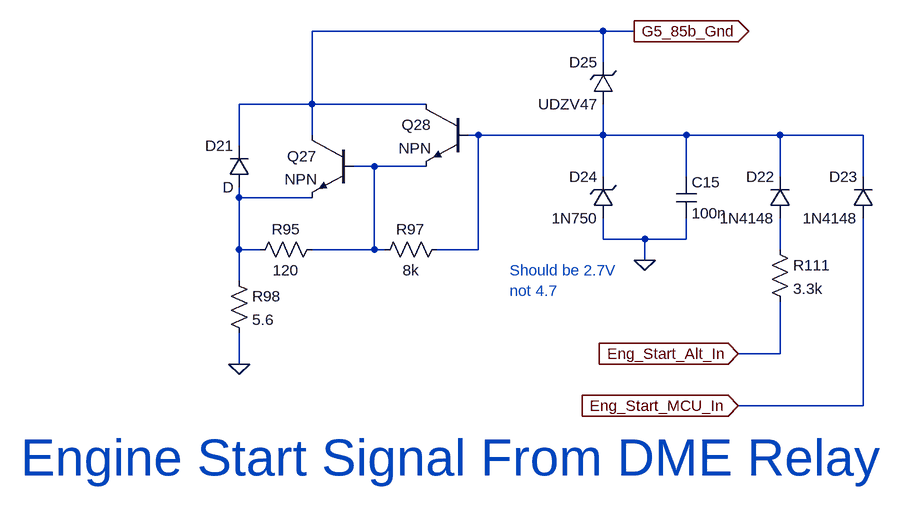
[diagram p0: schematic engine_start.asc]
engine_start.asc, the LTspice schematic file:
Version 4
SHEET 1 4356 3824
WIRE -1856 -3440 -2304 -3440
WIRE -1808 -3440 -1856 -3440
WIRE -1856 -3392 -1856 -3440
WIRE -2304 -3328 -2304 -3440
WIRE -2304 -3328 -2416 -3328
WIRE -2128 -3328 -2304 -3328
WIRE -2304 -3280 -2304 -3328
WIRE -2048 -3280 -2064 -3280
WIRE -1856 -3280 -1856 -3328
WIRE -1856 -3280 -2048 -3280
WIRE -1728 -3280 -1856 -3280
WIRE -1584 -3280 -1728 -3280
WIRE -1456 -3280 -1584 -3280
WIRE -2416 -3264 -2416 -3328
WIRE -2208 -3232 -2240 -3232
WIRE -2128 -3232 -2208 -3232
WIRE -1856 -3216 -1856 -3280
WIRE -1728 -3216 -1728 -3280
WIRE -1584 -3216 -1584 -3280
WIRE -1456 -3216 -1456 -3280
WIRE -2416 -3184 -2416 -3200
WIRE -2304 -3184 -2416 -3184
WIRE -1856 -3120 -1856 -3152
WIRE -1792 -3120 -1856 -3120
WIRE -1728 -3120 -1728 -3152
WIRE -1728 -3120 -1792 -3120
WIRE -2416 -3104 -2416 -3184
WIRE -2384 -3104 -2416 -3104
WIRE -2208 -3104 -2208 -3232
WIRE -2208 -3104 -2304 -3104
WIRE -2192 -3104 -2208 -3104
WIRE -2048 -3104 -2048 -3280
WIRE -2048 -3104 -2112 -3104
WIRE -1584 -3104 -1584 -3152
WIRE -1792 -3088 -1792 -3120
WIRE -2416 -3056 -2416 -3104
WIRE -1584 -2944 -1584 -3024
WIRE -1584 -2944 -1648 -2944
WIRE -2416 -2928 -2416 -2976
WIRE -1456 -2864 -1456 -3152
WIRE -1456 -2864 -1648 -2864
FLAG -2416 -2928 0
FLAG -1808 -3440 G5_85b_Gnd
IOPIN -1808 -3440 Out
FLAG -1792 -3088 0
FLAG -1648 -2944 Eng_Start_Alt_In
IOPIN -1648 -2944 In
FLAG -1648 -2864 Eng_Start_MCU_In
IOPIN -1648 -2864 In
SYMBOL npn -2240 -3280 M0
SYMATTR InstName Q27
SYMBOL npn -2064 -3328 M0
SYMATTR InstName Q28
SYMBOL diode -2400 -3200 R180
WINDOW 0 24 64 Left 2
WINDOW 3 24 0 Left 2
SYMATTR InstName D21
SYMBOL Res -2288 -3120 R90
WINDOW 0 0 56 VBottom 2
WINDOW 3 32 56 VTop 2
SYMATTR InstName R95
SYMATTR Value 120
SYMBOL Res -2208 -3088 R270
WINDOW 0 32 56 VTop 2
WINDOW 3 0 56 VBottom 2
SYMATTR InstName R97
SYMATTR Value 8k
SYMBOL Res -2432 -3072 R0
SYMATTR InstName R98
SYMATTR Value 5.6
SYMBOL diode -1568 -3152 R180
WINDOW 0 24 64 Left 2
WINDOW 3 24 0 Left 2
SYMATTR InstName D22
SYMATTR Value 1N4148
SYMBOL Diode -1440 -3152 R180
WINDOW 0 24 64 Left 2
WINDOW 3 24 0 Left 2
SYMATTR InstName D23
SYMATTR Value 1N4148
SYMBOL Res -1600 -3120 R0
SYMATTR InstName R111
SYMATTR Value 3.3k
SYMBOL Cap -1744 -3216 R0
SYMATTR InstName C15
SYMATTR Value 100n
SYMBOL zener -1840 -3152 R180
WINDOW 0 24 64 Left 2
WINDOW 3 24 0 Left 2
SYMATTR InstName D24
SYMATTR Value 1N750
SYMBOL zener -1840 -3328 R180
WINDOW 0 24 64 Left 2
WINDOW 3 24 0 Left 2
SYMATTR InstName D25
SYMATTR Value UDZV47
TEXT -2752 -2784 Left 6 ;Engine Start Signal From DME Relay
TEXT -2000 -3072 Left 2 ;Should be 2.7V\nnot 4.7

The netlist it stands for:
* engine_start.asc
Q27 G5_85b_Gnd N002 N003 0 NPN
Q28 G5_85b_Gnd N001 N002 0 NPN
D21 N003 G5_85b_Gnd D
R95 N002 N003 120
R97 N002 N001 8k
R98 N003 0 5.6
D22 N004 N001 1N4148
D23 Eng_Start_MCU_In N001 1N4148
R111 N004 Eng_Start_Alt_In 3.3k
C15 N001 0 100n
D24 0 N001 1N750
D25 N001 G5_85b_Gnd UDZV47
.model D D
.lib standard.dio
.model NPN NPN
.model PNP PNP
.lib standard.bjt
* Engine Start Signal From DME Relay
* Should be 2.7V
* not 4.7
.backanno
.end